# Altium schematic sheet external_ps_en.SchDoc
size A
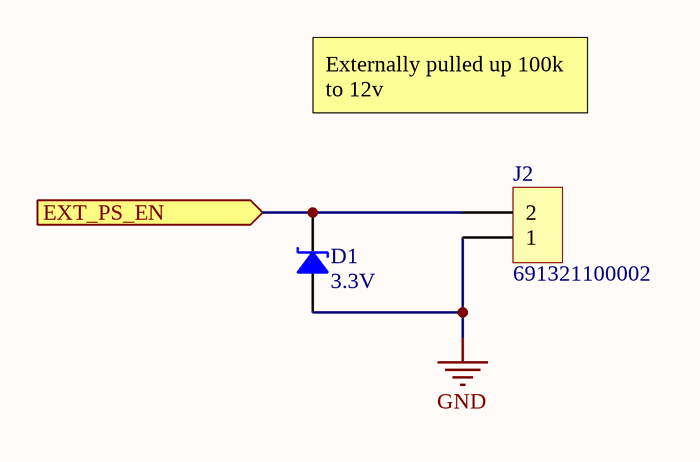
[diagram p0: external_ps_en.SchDoc]

## Parts
D1  3.3V  [SOD123F]
J2  691321100002  [691322110002]

## Ports
EXT_PS_EN (in)

## Nets
GND: D1.1 J2.1
EXT_PS_EN: D1.2 J2.2 ; port EXT_PS_EN

## Notes on the sheet
- Externally pulled up 100k to 12v

## Library data of the parts
D1 = Diode Zener: Zener Diode
J2 = 691321100002: WR-TBL Terminal block - serie 3211 - 3.50 mm; Manufacturer: Würth Elektronik eiSos GmbH; ComponentLink1 Description: Manufacturer; ComponentLink2 Description: Datasheet; NoPins: 2; Created Date: 9 December 2013; partNo: 691321100002; ComponentLink1URL: http://www.we-online.com; ComponentLink2URL: http://katalog.we-online.de/em/datasheet/6913211000xx.pdf; Created by: Karrer Zheng